# Altium project gamepad_V1.0.PrjPcb
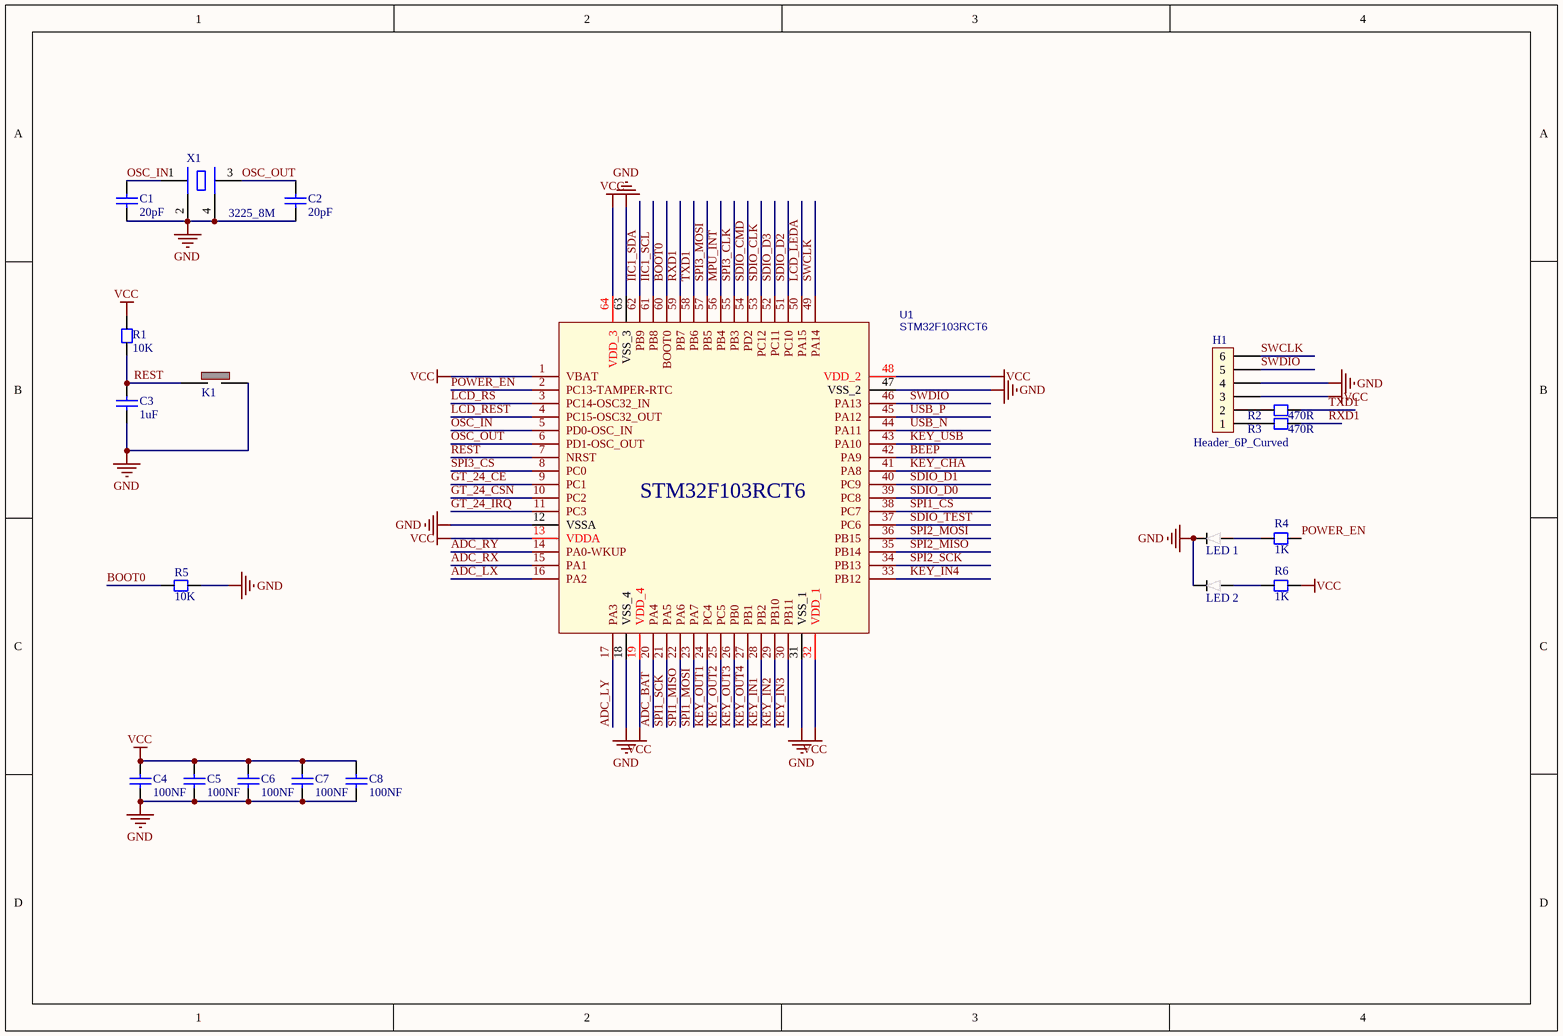
[diagram p0: Sheet0-mcu.SchDoc]
5 sheets, 142 parts. Net scope: global (net labels, ports and power ports of the same name join across sheets).
Board file: PCB.PcbDoc
Sheets:
  Sheet0-mcu.SchDoc
  Sheet1-control.SchDoc
  Sheet2-USB.SchDoc
  recv_board.SchDoc
  Sheet3-key.SchDoc

## Sheet Sheet0-mcu.SchDoc
size A4; SheetNumber: 1; SheetTotal: 6

### Parts
C1  20pF  [CC1608-0603]
C2  20pF  [CC1608-0603]
C3  1uF  [CC1608-0603]
C4  100NF  [CC1608-0603]
C5  100NF  [CC1608-0603]
C6  100NF  [CC1608-0603]
C7  100NF  [CC1608-0603]
C8  100NF  [CC1608-0603]
H1  Header_6P_Curved  [Header_2_54_6PW]
K1  KEY 3*4  [KEY 3*4]  (value not drawn)
LED_1  LED 0603  [LED 0603]  (value not drawn)
LED_2  LED 0603  [LED 0603]  (value not drawn)
R1  10K  [CR1608-0603]
R2  470R  [CR1608-0603]
R3  470R  [CR1608-0603]
R4  1K  [CR1608-0603]
R5  10K  [CR1608-0603]
R6  1K  [CR1608-0603]
U1  STM32F103RCT6  [LQFP-64]
X1  3225_8M  [XTAL-3225]

### Nets
GND: C1.1 C2.1 C3.1 C4.1 C5.1 C6.1 C7.1 C8.1 H1.4 K1.2 LED_1.2 LED_2.2 R5.1 U1.12(VSSA) U1.18(VSS_4) U1.31(VSS_1) U1.47(VSS_2) U1.63(VSS_3) X1.2(GND) X1.4(GND)
VCC: C4.2 C5.2 C6.2 C7.2 C8.2 H1.3 R1.2 R6.1 U1.1(VBAT) U1.13(VDDA) U1.19(VDD_4) U1.32(VDD_1) U1.48(VDD_2) U1.64(VDD_3)  [project net 3.3V]
ADC_BAT: U1.20(PA4)
ADC_LX: U1.16(PA2)
ADC_LY: U1.17(PA3)
ADC_RX: U1.15(PA1)
ADC_RY: U1.14(PA0-WKUP)
BEEP: U1.42(PA9)
BOOT0: R5.2 U1.60(BOOT0)
GT_24_CE: U1.9(PC1)
GT_24_CSN: U1.10(PC2)
GT_24_IRQ: U1.11(PC3)
IIC1_SCL: U1.61(PB8)
IIC1_SDA: U1.62(PB9)
KEY_CHA: U1.41(PA8)
KEY_IN1: U1.28(PB2)
KEY_IN2: U1.29(PB10)
KEY_IN3: U1.30(PB11)
KEY_IN4: U1.33(PB12)
KEY_OUT1: U1.24(PC4)
KEY_OUT2: U1.25(PC5)
KEY_OUT3: U1.26(PB0)
KEY_OUT4: U1.27(PB1)
KEY_USB: U1.43(PA10)
LCD_LEDA: U1.50(PA15)
LCD_REST: U1.4(PC15-OSC32_OUT)
LCD_RS: U1.3(PC14-OSC32_IN)
MPU_INT: U1.56(PB4)
OSC_IN: C1.2 U1.5(PD0-OSC_IN) X1.1(OSC1)
OSC_OUT: C2.2 U1.6(PD1-OSC_OUT) X1.3(OSC2)
POWER_EN: R4.1 U1.2(PC13-TAMPER-RTC)
REST: C3.2 K1.1 R1.1 U1.7(NRST)
RXD1: R3.1 U1.59(PB7)
SDIO_CLK: U1.53(PC12)
SDIO_CMD: U1.54(PD2)
SDIO_D0: U1.39(PC8)
SDIO_D1: U1.40(PC9)
SDIO_D2: U1.51(PC10)
SDIO_D3: U1.52(PC11)
SDIO_TEST: U1.37(PC6)
SPI1_CS: U1.38(PC7)
SPI1_MISO: U1.22(PA6)
SPI1_MOSI: U1.23(PA7)
SPI1_SCK: U1.21(PA5)
SPI2_MISO: U1.35(PB14)
SPI2_MOSI: U1.36(PB15)
SPI2_SCK: U1.34(PB13)
SPI3_CLK: U1.55(PB3)
SPI3_CS: U1.8(PC0)
SPI3_MOSI: U1.57(PB5)
SWCLK: H1.6 U1.49(PA14)
SWDIO: H1.5 U1.46(PA13)
TXD1: R2.1 U1.58(PB6)
USB_N: U1.44(PA11)
USB_P: U1.45(PA12)
NetH1_1: H1.1 R3.2
NetH1_2: H1.2 R2.2
NetLED_1_1: LED_1.1 R4.2
NetLED_2_1: LED_2.1 R6.2

### Library data of the parts
C1-C8 = Cap Chip 0603: 0603封装的电容; Published: 8-Jun-2000; Revision: July-2002: Re-released for DXP Platform.; Publisher: Altium Limited
H1 = Header_6P_Curved: 弯的6P排针
K1 = KEY 3*4: 轻触开关按键
R1 R4-R6 = Resistor Chip 0603: 0603封装电阻; Published: 8-Jun-2000; Revision: July-2002: Re-released for DXP Platform.; Publisher: Altium Limited
R2 R3 = Chip resistor: 贴片电阻
U1 = STM32F103RCT6: BOM_Manufacturer: ST(意法半导体); BOM_Supplier: LCSC; BOM_Manufacturer Part: STM32F103RCT6; BOM_Supplier Part: C8323; BOM_JLCPCB Part Class: Extended Part; spicePre: U; spiceSymbolName: STM32F103RCT6
X1 = XTAL 3225: 3225封装的晶振

## Sheet Sheet1-control.SchDoc
size A3; SheetNumber: 2; SheetTotal: 6
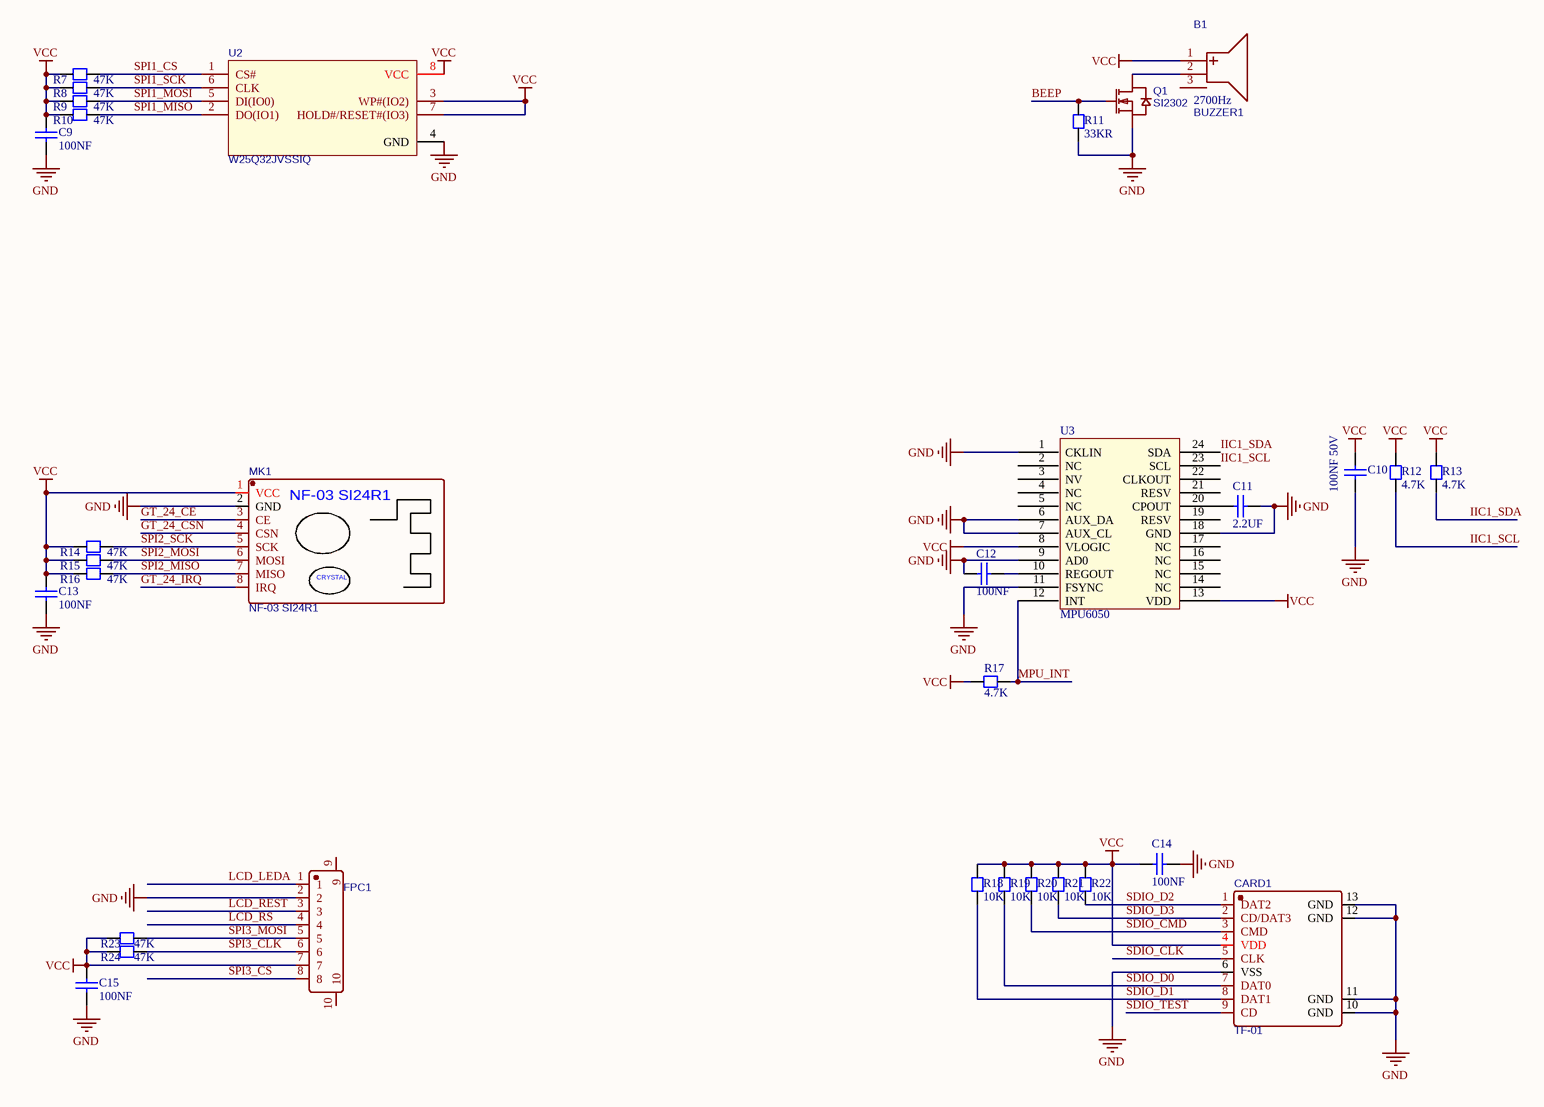
[diagram p1: Sheet1-control.SchDoc]

### Parts
B1  BUZZER1  [BUZ-SMD_GSC7525RA]
C9  100NF  [CC1608-0603]
C10  100NF 50V  [CC1608-0603]
C11  2.2UF  [CC1608-0603]
C12  100NF  [CC1608-0603]
C13  100NF  [CC1608-0603]
C14  100NF  [CC1608-0603]
C15  100NF  [CC1608-0603]
CARD1  TF-01  [TF-SMD_TF-15-15]
FPC1  FFC 05 8P  [FFC-SMD_8P-P0.50]  (value not drawn)
MK1  NF-03 SI24R1  [NF-03 SI24R1]
Q1  SI2302  [SOT-23]
R7  47K  [CR1608-0603]
R8  47K  [CR1608-0603]
R9  47K  [CR1608-0603]
R10  47K  [CR1608-0603]
R11  33KR  [CR1608-0603]
R12  4.7K  [CR1608-0603]
R13  4.7K  [CR1608-0603]
R14  47K  [CR1608-0603]
R15  47K  [CR1608-0603]
R16  47K  [CR1608-0603]
R17  4.7K  [CR1608-0603]
R18  10K  [CR1608-0603]
R19  10K  [CR1608-0603]
R20  10K  [CR1608-0603]
R21  10K  [CR1608-0603]
R22  10K  [CR1608-0603]
R23  47K  [CR1608-0603]
R24  47K  [CR1608-0603]
U2  W25Q32JVSSIQ  [SOIC-8-W25Q]
U3  MPU6050  [QFN24 - duplicate]

### Nets
GND: C9.1 C10.1 C11.2 C12.1 C13.1 C14.1 C15.1 CARD1.6(VSS) CARD1.10(GND) CARD1.11(GND) CARD1.12(GND) CARD1.13(GND) FPC1.2 MK1.2(GND) Q1.2(S) R11.2 U2.4(GND) U3.1(CKLIN) U3.6(AUX_DA) U3.7(AUX_CL) U3.9(AD0) U3.11(FSYNC) U3.18(GND)
VCC: B1.1(+) C9.2 C10.2 C13.2 C14.2 C15.2 CARD1.4(VDD) FPC1.7 MK1.1(VCC) R7.1 R8.1 R9.1 R10.1 R12.1 R13.1 R14.1 R15.1 R16.1 R17.1 R18.1 R19.1 R20.1 R21.1 R22.1 R23.2 R24.2 U2.3(WP#(IO2)) U2.7(HOLD#/RESET#(IO3)) U2.8(VCC) U3.8(VLOGIC) U3.13(VDD)  [project net 3.3V]
BEEP: Q1.1(G) R11.1
GT_24_CE: MK1.3(CE)
GT_24_CSN: MK1.4(CSN)
GT_24_IRQ: MK1.8(IRQ)
IIC1_SCL: R12.2 U3.23(SCL)
IIC1_SDA: R13.2 U3.24(SDA)
LCD_LEDA: FPC1.1
LCD_REST: FPC1.3
LCD_RS: FPC1.4
MPU_INT: R17.2 U3.12(INT)
SDIO_CLK: CARD1.5(CLK)
SDIO_CMD: CARD1.3(CMD) R20.2
SDIO_D0: CARD1.7(DAT0) R19.2
SDIO_D1: CARD1.8(DAT1) R18.2
SDIO_D2: CARD1.1(DAT2) R22.2
SDIO_D3: CARD1.2(CD/DAT3) R21.2
SDIO_TEST: CARD1.9(CD)
SPI1_CS: R7.2 U2.1(CS#)
SPI1_MISO: R10.2 U2.2(DO(IO1))
SPI1_MOSI: R9.2 U2.5(DI(IO0))
SPI1_SCK: R8.2 U2.6(CLK)
SPI2_MISO: MK1.7(MISO) R16.2
SPI2_MOSI: MK1.6(MOSI) R15.2
SPI2_SCK: MK1.5(SCK) R14.2
SPI3_CLK: FPC1.6 R24.1
SPI3_CS: FPC1.8
SPI3_MOSI: FPC1.5 R23.1
NetB1_2: B1.2(-) Q1.3(D)
NetC11_1: C11.1 U3.20(CPOUT)
NetC12_2: C12.2 U3.10(REGOUT)

Not connected (* = marked no-connect by the designer): B1 3(EH); FPC1 9 10; U3 2(NC) 3(NV) 4(NC) 5(NC) 14(NC) 15(NC) 16(NC) 17(NC) 19(RESV) 21(RESV) 22(CLKOUT)

### Notes on the sheet
- (in symbol NF-03 SI24R1) CRYSTAL

### Library data of the parts
B1 = BUZZER1: 2700Hz; Manufacturer: INGHAi(赢海); Manufacturer Part: GSC7525RA-16R2700; Contributor: LCSC; nameAlias: Value; Supplier: LCSC; Supplier Part: C255313; spicePre: B; spiceSymbolName: GSC7525RA-16R2700
C9-C15 = Cap Chip 0603: 0603封装的电容; Published: 8-Jun-2000; Revision: July-2002: Re-released for DXP Platform.; Publisher: Altium Limited
CARD1 = TF-01: Manufacturer: Yuandi(元迪); Contributor: LCSC; Supplier: LCSC; Supplier Part: C2889257; Manufacturer Part: TF-01; JLCPCB Part Class: Extended Part; spicePre: C; spiceSymbolName: TF-01
FPC1 = FFC 05 8P: Manufacturer: TXGA(特思嘉); Manufacturer Part: FFC05001-08SBB124W5M-H; Contributor: LCSC; Supplier: LCSC; Supplier Part: C456420; JLCPCB Part Class: Extended Part; spicePre: F; spiceSymbolName: FFC05001-08SBB124W5M-H
MK1 = NF-03 SI24R1: Manufacturer: Ashining(泽耀科技); Manufacturer Part: AS01-ML01S; Supplier: LCSC; Supplier Part: C84802; JLCPCB Part Class: Extended Part; spicePre: M; spiceSymbolName: AS01-ML01S
Q1 = SI2302: N沟道 / 漏源电压(Vdss) 20V / 连续漏极电流(Id) 2.8A / 功率(Pd) 900mW / 导通电阻(RDS(on)@Vgs,Id) 55mΩ@4.5V,2.8A / 阈值电压(Vgs(th)@Id) 1.2V@250uA / 输入电容(Ciss@Vds) 260pF@10V; Manufacturer: TWGMC(台湾迪嘉); Manufacturer Part: SI2306; Contributor: LCSC; Supplier: LCSC; Supplier Part: C727154; JLCPCB Part Class: Extended Part; spicePre: Q; spiceSymbolName: SI2306_C727154
R7-R11 = Chip resistor: 贴片电阻
R12-R24 = Resistor Chip 0603: 0603封装电阻; Published: 8-Jun-2000; Revision: July-2002: Re-released for DXP Platform.; Publisher: Altium Limited
U2 = W25Q32JVSSIQ: Manufacturer: WINBOND(华邦); Manufacturer Part: W25Q128JVPIQ; Contributor: LCSC; Supplier: LCSC; Supplier Part: C2803379; JLCPCB Part Class: Extended Part; spicePre: U; spiceSymbolName: W25Q128JVPIQ
U3 = MPU6050: 陀螺仪

## Sheet Sheet2-USB.SchDoc
size A4; SheetNumber: 3; SheetTotal: 6
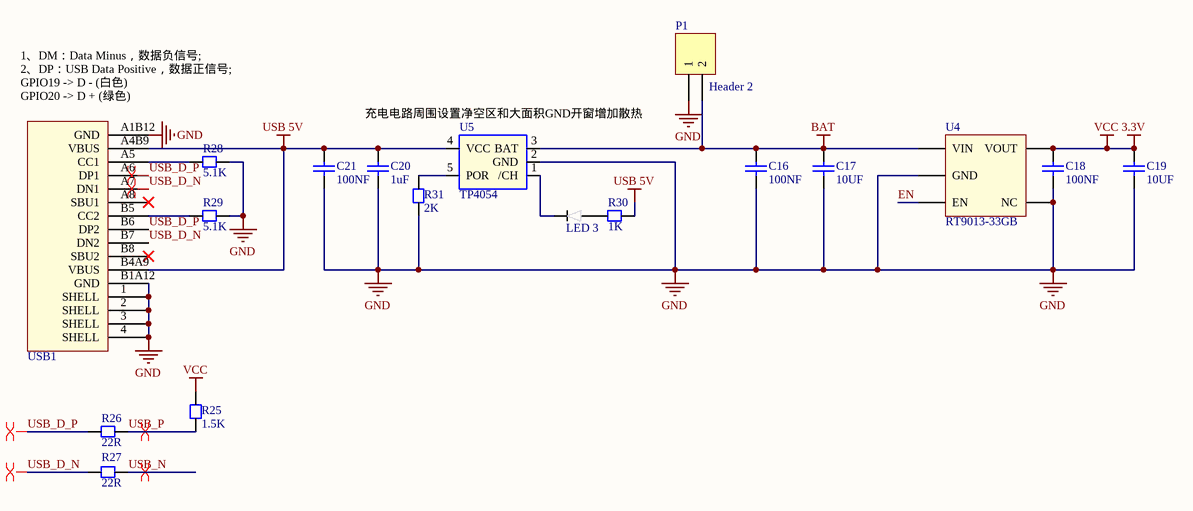
[diagram p2: Sheet2-USB.SchDoc]

### Parts
C16  100NF  [CC1608-0603]
C17  10UF  [CC1608-0603]
C18  100NF  [CC1608-0603]
C19  10UF  [CC1608-0603]
C20  1uF  [CC1608-0603]
C21  100NF  [CC1608-0603]
LED_3  LED 0603  [LED 0603]  (value not drawn)
P1  Header 2  [HX2.54-2]
R25  1.5K  [CR1608-0603]
R26  22R  [CR1608-0603]
R27  22R  [CR1608-0603]
R28  5.1K  [CR1608-0603]
R29  5.1K  [CR1608-0603]
R30  1K  [CR1608-0603]
R31  2K  [CR1608-0603]
U4  RT9013-33GB  [SOT23-5]
U5  TP4054  [SOT23-5]
USB1  Tpye-c 16P  [TYPE-C 16P]  (value not drawn)

### Nets
3.3V: C18.2 C19.2 R25.1 U4.5(VOUT)  [also labelled VCC]
BAT: C16.2 C17.2 P1.2 U4.1(VIN) U5.3(BAT)
GND: C16.1 C17.1 C18.1 C19.1 C20.1 C21.1 P1.1 R28.1 R29.1 R31.2 U4.2(GND) U4.4(NC) U5.2(GND) USB1.1(SHELL) USB1.2(SHELL) USB1.3(SHELL) USB1.4(SHELL) USB1.A1B12(GND) USB1.B1A12(GND)
USB 5V: C20.2 C21.2 R30.1 U5.4(VCC) USB1.A4B9(VBUS) USB1.B4A9(VBUS)
EN: U4.3(EN)
USB_D_N: R27.2 USB1.A7(DN1) USB1.B7(DN2)
USB_D_P: R26.2 USB1.A6(DP1) USB1.B6(DP2)
USB_N: R27.1
USB_P: R25.2 R26.1
NetLED_3_1: LED_3.1 R30.2
NetLED_3_2: LED_3.2 U5.1(/CH)
NetR28_2: R28.2 USB1.A5(CC1)
NetR29_2: R29.2 USB1.B5(CC2)
NetR31_1: R31.1 U5.5(POR)

Not connected (* = marked no-connect by the designer): USB1 A8(SBU1)* B8(SBU2)*

### Layout directives
differential pair: USB_D_N, USB_D_P, USB_N, USB_P

### Notes on the sheet
- (near USB1) 1、DM：Data Minus，数据负信号;
  2、DP：USB Data Positive，数据正信号;
  GPIO19 -> D - (白色)
  GPIO20 -> D + (绿色)
- 充电电路周围设置净空区和大面积GND开窗增加散热

### Library data of the parts
C16-C21 = Cap Chip 0603: 0603封装的电容; Published: 8-Jun-2000; Revision: July-2002: Re-released for DXP Platform.; Publisher: Altium Limited
P1 = Header 2: Header, 2-Pin; LatestRevisionDate: 17-Jul-2002; LatestRevisionNote: Re-released for DXP Platform.; Publisher: Altium Limited
R25-R31 = Resistor Chip 0603: 0603封装电阻; Published: 8-Jun-2000; Revision: July-2002: Re-released for DXP Platform.; Publisher: Altium Limited
U4 = RT9013-33GB: LDO 2.2-5.2V IN 500Ma OUT SOT23-5
U5 = TP4054: 迷你充电IC SOT-23-5
USB1 = Tpye-c 16P: 16P 封装的TYPE -c接口 4固定插脚 双向

## Sheet recv_board.SchDoc
size A3; SheetNumber: 5; SheetTotal: 6
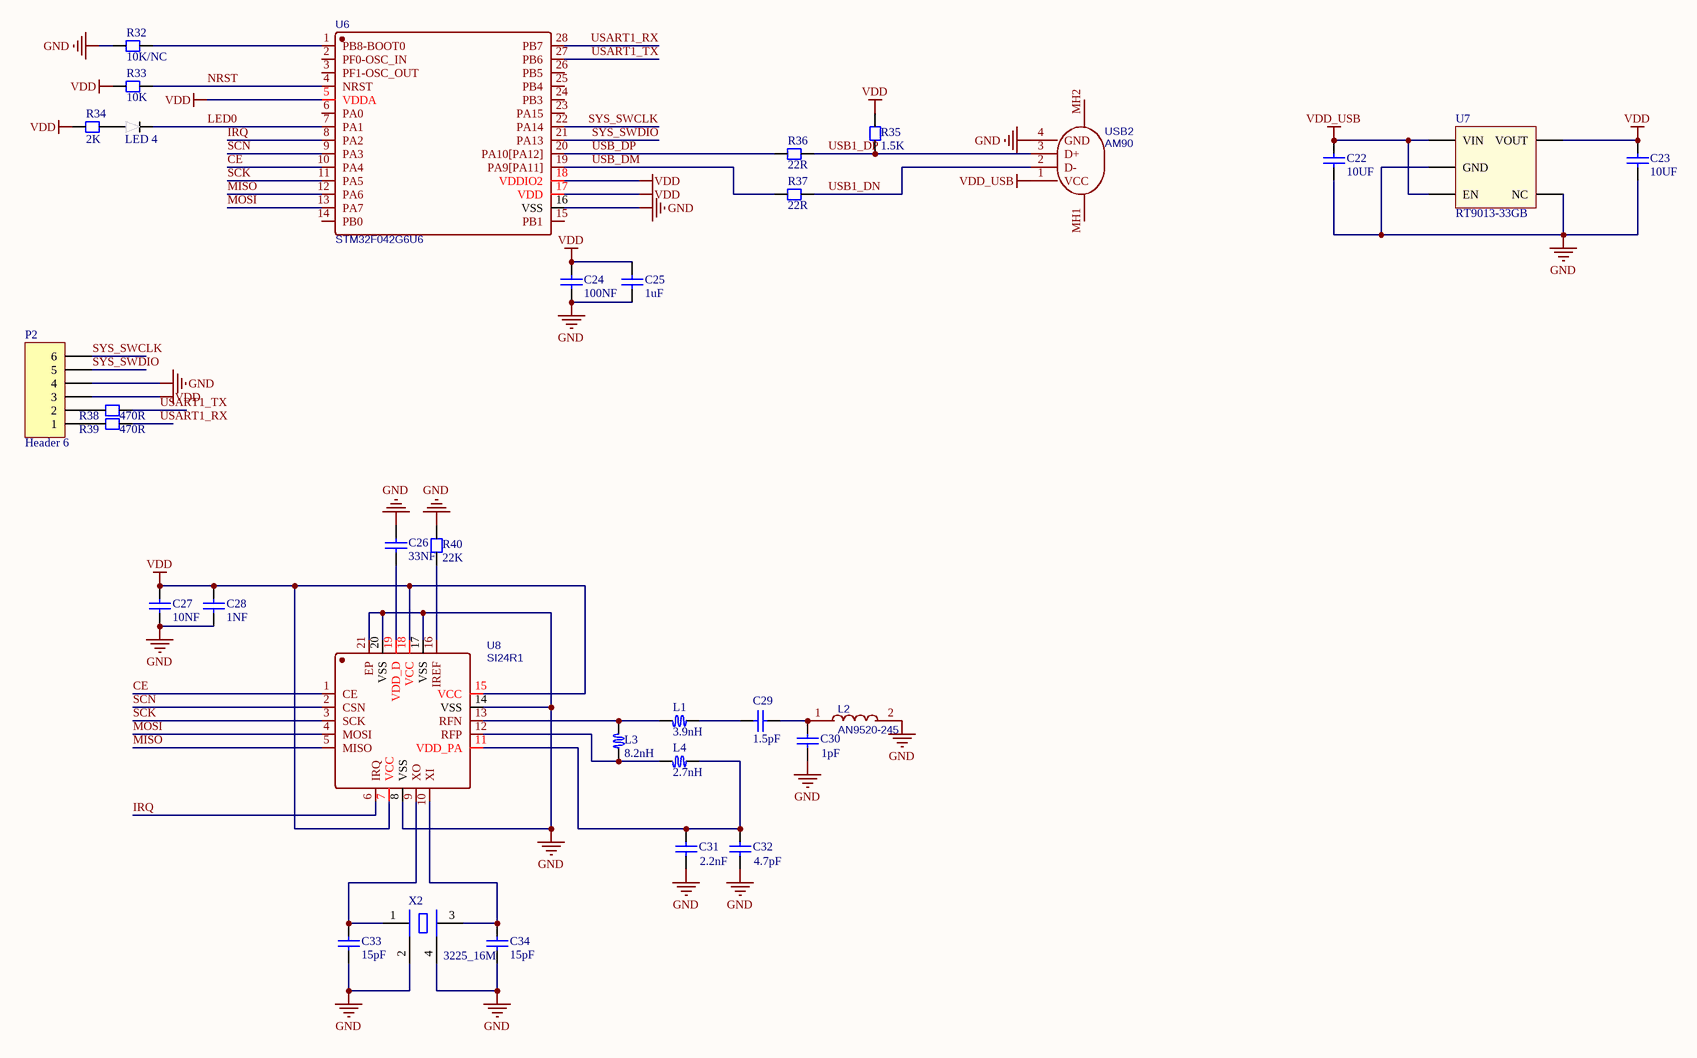
[diagram p3: recv_board.SchDoc]

### Parts
C22  10UF  [CC1608-0603]
C23  10UF  [CC1608-0603]
C24  100NF  [CC1608-0603]
C25  1uF  [CC1608-0603]
C26  33NF  [CC1608-0603]
C27  10NF  [CC1608-0603]
C28  1NF  [CC1608-0603]
C29  1.5pF  [CC1608-0603]
C30  1pF  [CC1608-0603]
C31  2.2nF  [CC1608-0603]
C32  4.7pF  [CC1608-0603]
C33  15pF  [CC1608-0603]
C34  15pF  [CC1608-0603]
L1  3.9nH  [Inductor-0603]
L2  AN9520-245  [ANT-SMD_L9.5-W2.1]
L3  8.2nH  [Inductor-0603]
L4  2.7nH  [Inductor-0603]
LED_4  LED 0603  [LED 0603]  (value not drawn)
P2  Header 6  [HDR1X6]
R32  10K/NC  [CR1608-0603]
R33  10K  [CR1608-0603]
R34  2K  [CR1608-0603]
R35  1.5K  [CR1608-0603]
R36  22R  [CR1608-0603]
R37  22R  [CR1608-0603]
R38  470R  [CR1608-0603]
R39  470R  [CR1608-0603]
R40  22K  [CR1608-0603]
U6  STM32F042G6U6  [UFQFPN-28]
U7  RT9013-33GB  [SOT23-5]
U8  SI24R1  [QFN-20]
USB2  AM90  [USB-AM]
X2  3225_16M  [XTAL-3225]

### Nets
GND: C22.1 C23.1 C24.1 C25.1 C26.2 C27.1 C28.1 C30.2 C31.2 C32.2 C33.1 C34.1 L2.2 P2.4 R32.1 R40.1 U6.16(VSS) U7.2(GND) U7.4(NC) U8.8(VSS) U8.14(VSS) U8.17(VSS) U8.20(VSS) U8.21(EP) USB2.4(GND) X2.2(GND) X2.4(GND)
VDD: C23.2 C24.2 C25.2 C27.2 C28.2 P2.3 R33.2 R34.2 R35.1 U6.5(VDDA) U6.17(VDD) U6.18(VDDIO2) U7.5(VOUT) U8.7(VCC) U8.15(VCC) U8.18(VCC)
VDD_USB: C22.2 U7.1(VIN) U7.3(EN) USB2.1(VCC)
CE: U6.10(PA4) U8.1(CE)
IRQ: U6.8(PA2) U8.6(IRQ)
LED0: LED_4.2 U6.7(PA1)
MISO: U6.12(PA6) U8.5(MISO)
MOSI: U6.13(PA7) U8.4(MOSI)
NRST: R33.1 U6.4(NRST)
SCK: U6.11(PA5) U8.3(SCK)
SCN: U6.9(PA3) U8.2(CSN)
SYS_SWCLK: P2.6 U6.22(PA14)
SYS_SWDIO: P2.5 U6.21(PA13)
USART1_RX: R39.1 U6.28(PB7)
USART1_TX: R38.1 U6.27(PB6)
USB1_DN: R37.1 USB2.2(D-)
USB1_DP: R35.2 R36.1 USB2.3(D+)
USB_DM: R37.2 U6.19(PA9[PA11])
USB_DP: R36.2 U6.20(PA10[PA12])
NetC26_1: C26.1 U8.19(VDD_D)
NetC29_1: C29.1 C30.1 L2.1
NetC29_2: C29.2 L1.1
NetC31_1: C31.1 C32.1 L4.1 U8.11(VDD_PA)
NetC33_2: C33.2 U8.9(XO) X2.1(OSC1)
NetC34_2: C34.2 U8.10(XI) X2.3(OSC2)
NetL1_2: L1.2 L3.2 U8.13(RFN)
NetL3_1: L3.1 L4.2 U8.12(RFP)
NetLED_4_1: LED_4.1 R34.1
NetP2_1: P2.1 R39.2
NetP2_2: P2.2 R38.2
NetR32_2: R32.2 U6.1(PB8-BOOT0)
NetR40_2: R40.2 U8.16(IREF)

Not connected (* = marked no-connect by the designer): U6 2(PF0-OSC_IN) 3(PF1-OSC_OUT) 6(PA0) 14(PB0) 15(PB1) 23(PA15) 24(PB3) 25(PB4) 26(PB5); USB2 MH1 MH2

### Library data of the parts
C22-C34 = Cap Chip 0603: 0603封装的电容; Published: 8-Jun-2000; Revision: July-2002: Re-released for DXP Platform.; Publisher: Altium Limited
L1 L3 L4 = Inductor-0603: 贴片电感 0603封装
L2 = AN9520-245: Manufacturer: rainsun(霖昱微); Supplier: LCSC; Manufacturer Part: AN9520-245; Supplier Part: C99665; JLCPCB Part Class: Extended Part; spicePre: L; spiceSymbolName: AN9520-245
P2 = Header 6: Header, 6-Pin; LatestRevisionDate: 17-Jul-2002; LatestRevisionNote: Re-released for DXP Platform.; Publisher: Altium Limited
R32-R37 R40 = Resistor Chip 0603: 0603封装电阻; Published: 8-Jun-2000; Revision: July-2002: Re-released for DXP Platform.; Publisher: Altium Limited
R38 R39 = Chip resistor: 贴片电阻
U6 = STM32F042G6U6: Manufacturer: ST(意法半导体); Contributor: LCSC; Supplier: LCSC; Supplier Part: C961597; Manufacturer Part: STM32F042G6U6; JLCPCB Part Class: Extended Part; spicePre: U; spiceSymbolName: STM32F042G6U6
U7 = RT9013-33GB: LDO 2.2-5.2V IN 500Ma OUT SOT23-5
U8 = SI24R1: Manufacturer: 南京中科微; nameAlias: Value; Supplier: LCSC; Manufacturer Part: Si24R1; Supplier Part: C14436; JLCPCB Part Class: Extended Part; spicePre: U; spiceSymbolName: Si24R1
USB2 = USB-AM90: Manufacturer: SHOU HAN(首韩); Contributor: LCSC; Supplier: LCSC; Supplier Part: C404965; Manufacturer Part: AM90; JLCPCB Part Class: Extended Part; spicePre: U; spiceSymbolName: AM90
X2 = XTAL 3225: 3225封装的晶振

## Sheet Sheet3-key.SchDoc
size A3; SheetNumber: 6; SheetTotal: 6
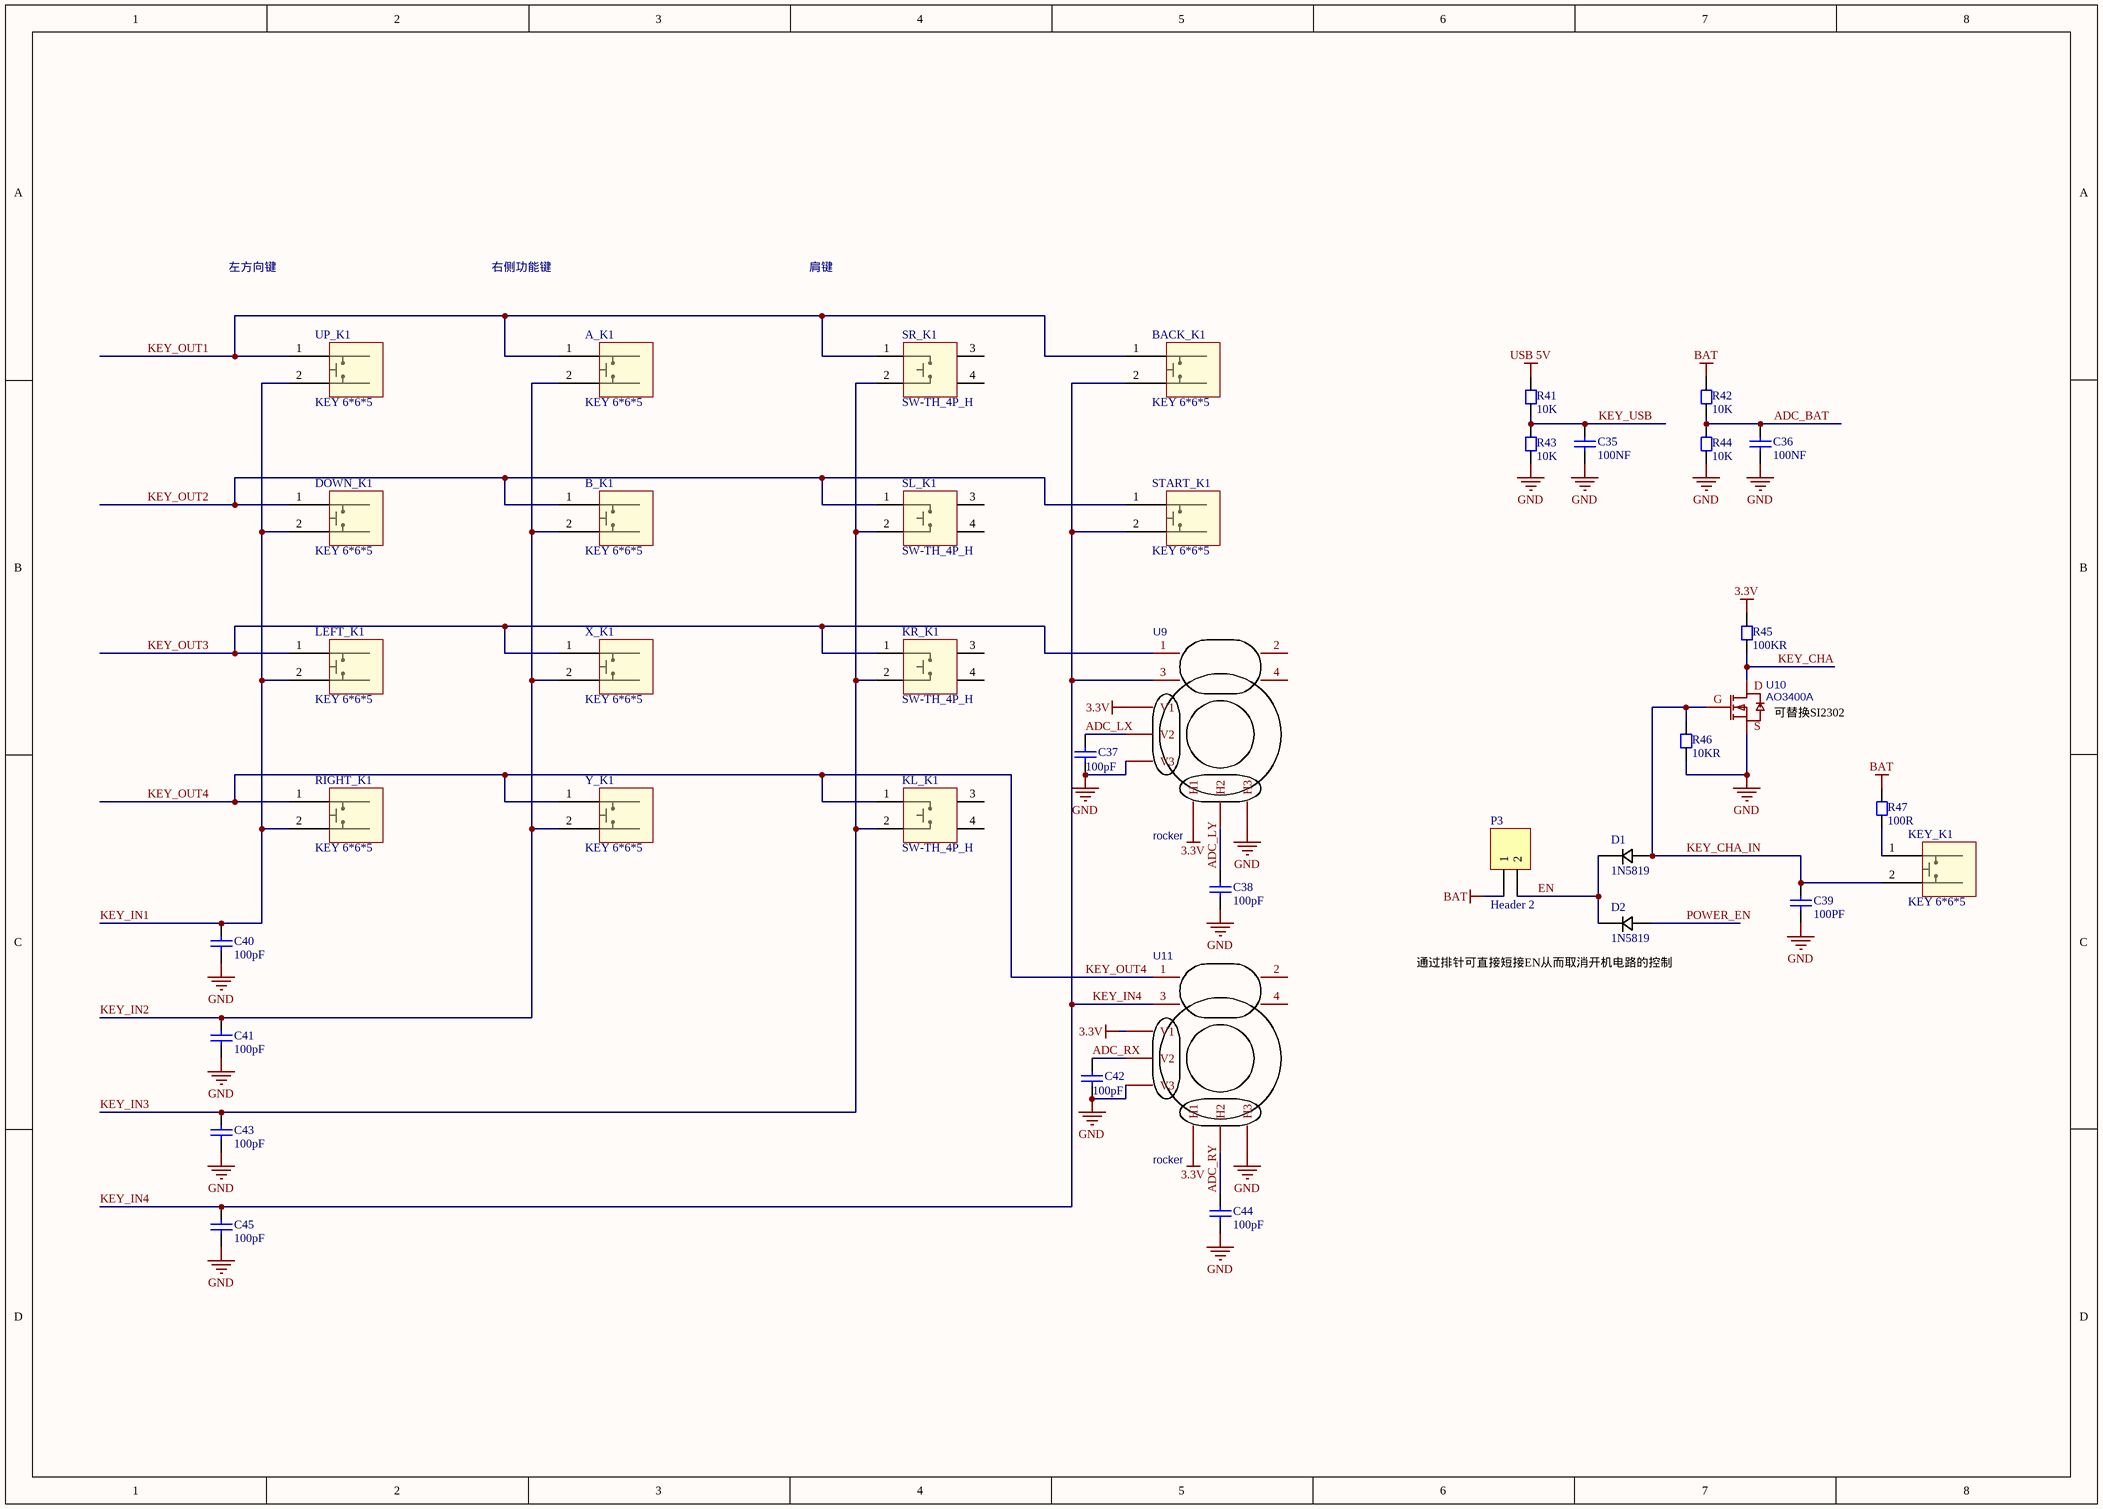
[diagram p4: Sheet3-key.SchDoc]

### Parts
A_K1  KEY 6*6*5  [KEY 6*6*5]
B_K1  KEY 6*6*5  [KEY 6*6*5]
BACK_K1  KEY 6*6*5  [KEY 6*6*5]
C35  100NF  [CC1608-0603]
C36  100NF  [CC1608-0603]
C37  100pF  [CC1608-0603]
C38  100pF  [CC1608-0603]
C39  100PF  [CC1608-0603]
C40  100pF  [CC1608-0603]
C41  100pF  [CC1608-0603]
C42  100pF  [CC1608-0603]
C43  100pF  [CC1608-0603]
C44  100pF  [CC1608-0603]
C45  100pF  [CC1608-0603]
D1  1N5819  [SOD-323_L1.8-W1.3-LS2.5-RD]
D2  1N5819  [SOD-323_L1.8-W1.3-LS2.5-RD]
DOWN_K1  KEY 6*6*5  [KEY 6*6*5]
KEY_K1  KEY 6*6*5  [KEY 6*6*5]
KL_K1  SW-TH_4P_H  [SW-TH_KH-6X6X7H-ZJ]
KR_K1  SW-TH_4P_H  [SW-TH_KH-6X6X7H-ZJ]
LEFT_K1  KEY 6*6*5  [KEY 6*6*5]
P3  Header 2  [HDR1X2]
R41  10K  [CR1608-0603]
R42  10K  [CR1608-0603]
R43  10K  [CR1608-0603]
R44  10K  [CR1608-0603]
R45  100KR  [CR1608-0603]
R46  10KR  [CR1608-0603]
R47  100R  [CR1608-0603]
RIGHT_K1  KEY 6*6*5  [KEY 6*6*5]
SL_K1  SW-TH_4P_H  [SW-TH_KH-6X6X7H-ZJ]
SR_K1  SW-TH_4P_H  [SW-TH_KH-6X6X7H-ZJ]
START_K1  KEY 6*6*5  [KEY 6*6*5]
U9  rocker  [PCBComponent_1]
U10  AO3400A  [SOT-23]
U11  rocker  [PCBComponent_1]
UP_K1  KEY 6*6*5  [KEY 6*6*5]
X_K1  KEY 6*6*5  [KEY 6*6*5]
Y_K1  KEY 6*6*5  [KEY 6*6*5]

### Nets
3.3V: R45.2 U9.5(V1) U9.8(H1) U11.5(V1) U11.8(H1)
BAT: P3.1 R42.2 R47.1
GND: C35.1 C36.1 C37.1 C38.1 C39.2 C40.1 C41.1 C42.1 C43.1 C44.1 C45.1 R43.1 R44.1 R46.1 U9.7(V3) U9.10(H3) U10.2(S) U11.7(V3) U11.10(H3)
USB 5V: R41.2
ADC_BAT: C36.2 R42.1 R44.2
ADC_LX: C37.2 U9.6(V2)
ADC_LY: C38.2 U9.9(H2)
ADC_RX: C42.2 U11.6(V2)
ADC_RY: C44.2 U11.9(H2)
EN: D1.1 D2.1 P3.2
KEY_CHA: R45.1 U10.3(D)
KEY_CHA_IN: C39.1 D1.2 KEY_K1.2 R46.2 U10.1(G)
KEY_IN1: C40.2 DOWN_K1.2 LEFT_K1.2 RIGHT_K1.2 UP_K1.2
KEY_IN2: A_K1.2 B_K1.2 C41.2 X_K1.2 Y_K1.2
KEY_IN3: C43.2 KL_K1.2 KR_K1.2 SL_K1.2 SR_K1.2
KEY_IN4: BACK_K1.2 C45.2 START_K1.2 U9.3 U11.3
KEY_OUT1: A_K1.1 BACK_K1.1 SR_K1.1 UP_K1.1
KEY_OUT2: B_K1.1 DOWN_K1.1 SL_K1.1 START_K1.1
KEY_OUT3: KR_K1.1 LEFT_K1.1 U9.1 X_K1.1
KEY_OUT4: KL_K1.1 RIGHT_K1.1 U11.1 Y_K1.1
KEY_USB: C35.2 R41.1 R43.2
POWER_EN: D2.2
NetKEY_K1_1: KEY_K1.1 R47.2

Not connected (* = marked no-connect by the designer): KL_K1 3 4; KR_K1 3 4; SL_K1 3 4; SR_K1 3 4; U9 2 4; U11 2 4

### Notes on the sheet
- 左方向键
- 右侧功能键
- 肩键
- (near U10) 可替换SI2302
- 通过排针可直接短接EN从而取消开机电路的控制

### Library data of the parts
A_K1 B_K1 BACK_K1 DOWN_K1 KEY_K1 LEFT_K1 RIGHT_K1 START_K1 UP_K1 X_K1 Y_K1 = KEY 6*6*5: 无声轻触开关
C35-C45 = Cap Chip 0603: 0603封装的电容; Published: 8-Jun-2000; Revision: July-2002: Re-released for DXP Platform.; Publisher: Altium Limited
D1 D2 = 1N5819: 肖特基二极管
KL_K1 KR_K1 SL_K1 SR_K1 = SW-TH_4P_H: 卧式轻触开关
P3 = Header 2: Header, 2-Pin; LatestRevisionDate: 17-Jul-2002; LatestRevisionNote: Re-released for DXP Platform.; Publisher: Altium Limited
R41-R44 R47 = Resistor Chip 0603: 0603封装电阻; Published: 8-Jun-2000; Revision: July-2002: Re-released for DXP Platform.; Publisher: Altium Limited
R45 R46 = Chip resistor: 贴片电阻
U9 U11 = rocker: Manufacturer Part: 摇杆; Contributor: Alex_Ai; spicePre: U; spiceSymbolName: 摇杆_直插_圆半径13_10电气脚_4固定脚 COPY
U10 = AO3400A: UMW AO3400A SOT-23 30V/5.8A N沟道 MOS(场效应管)芯片; Manufacturer: ElecSuper(静芯微）; Manufacturer Part: AO3401A; Contributor: lcsc; Supplier: LCSC; Supplier Part: C5224202; JLCPCB Part Class: Extended Part; link: https://so.szlcsc.com/global.html?k=C5224202&ref=editor; spicePre: U; spiceSymbolName: AO3401A_C5224202

## Nets that join several sheets
3.3V: Sheet0-mcu (14 pins), Sheet1-control (31 pins), Sheet2-USB (C18.2 C19.2 R25.1 U4.5), Sheet3-key (5 pins)
BAT: Sheet2-USB (5 pins), Sheet3-key (P3.1 R42.2 R47.1)
GND: Sheet0-mcu (20 pins), Sheet1-control (23 pins), Sheet2-USB (19 pins), recv_board (27 pins), Sheet3-key (19 pins)
USB 5V: Sheet2-USB (6 pins), Sheet3-key (R41.2)
ADC_BAT: Sheet0-mcu (U1.20), Sheet3-key (C36.2 R42.1 R44.2)
ADC_LX: Sheet0-mcu (U1.16), Sheet3-key (C37.2 U9.6)
ADC_LY: Sheet0-mcu (U1.17), Sheet3-key (C38.2 U9.9)
ADC_RX: Sheet0-mcu (U1.15), Sheet3-key (C42.2 U11.6)
ADC_RY: Sheet0-mcu (U1.14), Sheet3-key (C44.2 U11.9)
BEEP: Sheet0-mcu (U1.42), Sheet1-control (Q1.1 R11.1)
EN: Sheet2-USB (U4.3), Sheet3-key (D1.1 D2.1 P3.2)
GT_24_CE: Sheet0-mcu (U1.9), Sheet1-control (MK1.3)
GT_24_CSN: Sheet0-mcu (U1.10), Sheet1-control (MK1.4)
GT_24_IRQ: Sheet0-mcu (U1.11), Sheet1-control (MK1.8)
IIC1_SCL: Sheet0-mcu (U1.61), Sheet1-control (R12.2 U3.23)
IIC1_SDA: Sheet0-mcu (U1.62), Sheet1-control (R13.2 U3.24)
KEY_CHA: Sheet0-mcu (U1.41), Sheet3-key (R45.1 U10.3)
KEY_IN1: Sheet0-mcu (U1.28), Sheet3-key (5 pins)
KEY_IN2: Sheet0-mcu (U1.29), Sheet3-key (5 pins)
KEY_IN3: Sheet0-mcu (U1.30), Sheet3-key (5 pins)
KEY_IN4: Sheet0-mcu (U1.33), Sheet3-key (5 pins)
KEY_OUT1: Sheet0-mcu (U1.24), Sheet3-key (A_K1.1 BACK_K1.1 SR_K1.1 UP_K1.1)
KEY_OUT2: Sheet0-mcu (U1.25), Sheet3-key (B_K1.1 DOWN_K1.1 SL_K1.1 START_K1.1)
KEY_OUT3: Sheet0-mcu (U1.26), Sheet3-key (KR_K1.1 LEFT_K1.1 U9.1 X_K1.1)
KEY_OUT4: Sheet0-mcu (U1.27), Sheet3-key (KL_K1.1 RIGHT_K1.1 U11.1 Y_K1.1)
KEY_USB: Sheet0-mcu (U1.43), Sheet3-key (C35.2 R41.1 R43.2)
LCD_LEDA: Sheet0-mcu (U1.50), Sheet1-control (FPC1.1)
LCD_REST: Sheet0-mcu (U1.4), Sheet1-control (FPC1.3)
LCD_RS: Sheet0-mcu (U1.3), Sheet1-control (FPC1.4)
MPU_INT: Sheet0-mcu (U1.56), Sheet1-control (R17.2 U3.12)
POWER_EN: Sheet0-mcu (R4.1 U1.2), Sheet3-key (D2.2)
SDIO_CLK: Sheet0-mcu (U1.53), Sheet1-control (CARD1.5)
SDIO_CMD: Sheet0-mcu (U1.54), Sheet1-control (CARD1.3 R20.2)
SDIO_D0: Sheet0-mcu (U1.39), Sheet1-control (CARD1.7 R19.2)
SDIO_D1: Sheet0-mcu (U1.40), Sheet1-control (CARD1.8 R18.2)
SDIO_D2: Sheet0-mcu (U1.51), Sheet1-control (CARD1.1 R22.2)
SDIO_D3: Sheet0-mcu (U1.52), Sheet1-control (CARD1.2 R21.2)
SDIO_TEST: Sheet0-mcu (U1.37), Sheet1-control (CARD1.9)
SPI1_CS: Sheet0-mcu (U1.38), Sheet1-control (R7.2 U2.1)
SPI1_MISO: Sheet0-mcu (U1.22), Sheet1-control (R10.2 U2.2)
SPI1_MOSI: Sheet0-mcu (U1.23), Sheet1-control (R9.2 U2.5)
SPI1_SCK: Sheet0-mcu (U1.21), Sheet1-control (R8.2 U2.6)
SPI2_MISO: Sheet0-mcu (U1.35), Sheet1-control (MK1.7 R16.2)
SPI2_MOSI: Sheet0-mcu (U1.36), Sheet1-control (MK1.6 R15.2)
SPI2_SCK: Sheet0-mcu (U1.34), Sheet1-control (MK1.5 R14.2)
SPI3_CLK: Sheet0-mcu (U1.55), Sheet1-control (FPC1.6 R24.1)
SPI3_CS: Sheet0-mcu (U1.8), Sheet1-control (FPC1.8)
SPI3_MOSI: Sheet0-mcu (U1.57), Sheet1-control (FPC1.5 R23.1)
USB_N: Sheet0-mcu (U1.44), Sheet2-USB (R27.1)
USB_P: Sheet0-mcu (U1.45), Sheet2-USB (R25.2 R26.1)